# Altium schematic sheet Connectors.SchDoc: Connectors
size A4; CompanyName: St. Cloud State University; Organization: Senior Design Project; Address1: Prosthetic Hand; Address2: Matthew Varas; Address3: Rachel Mertz; Address4: Donnell Jones; DocumentNumber: 2; Revision: 1.1; SheetNumber: 2; SheetTotal: 6
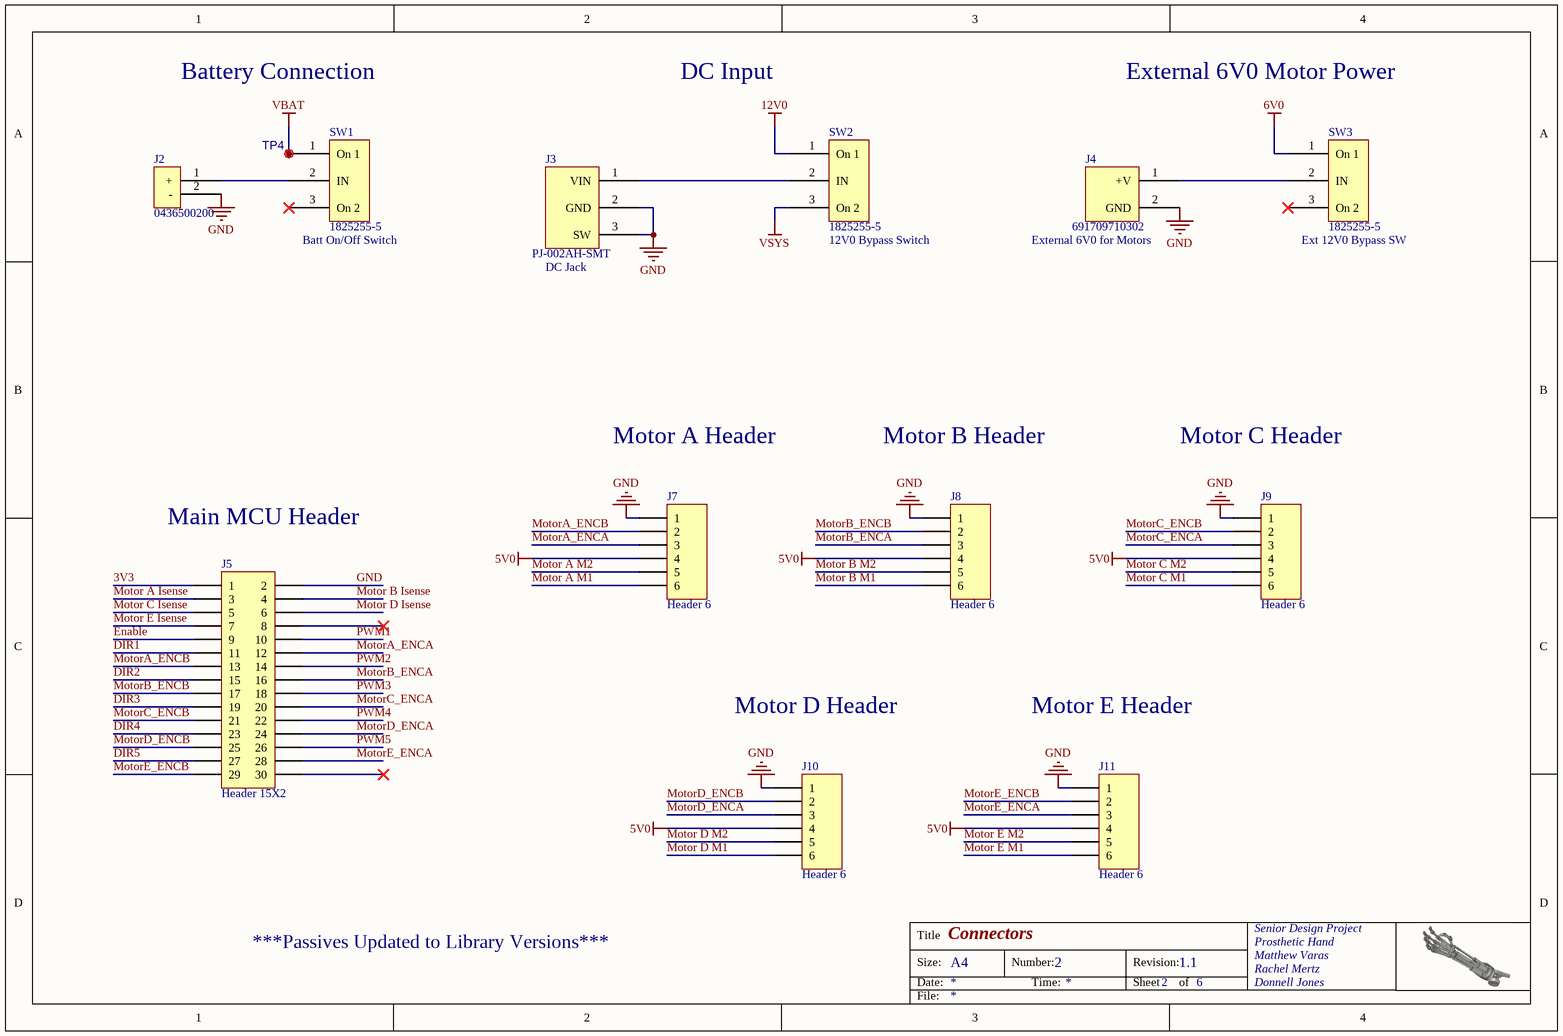
[diagram p0: Connectors.SchDoc]

## Parts
J2  0436500200  [43650-0200]
J3  PJ-002AH-SMT  [PJ-002AH-SMT]
J4  691709710302  [2-Pin Screw Terminal]
J5  Header 15X2  [HDR2X15]
J7  Header 6  [HDR1X6]
J8  Header 6  [HDR1X6]
J9  Header 6  [HDR1X6]
J10  Header 6  [HDR1X6]
J11  Header 6  [HDR1X6]
SW1  1825255-5  [On/Off/On Slider Switch]
SW2  1825255-5  [On/Off/On Slider Switch]
SW3  1825255-5  [On/Off/On Slider Switch]
TP4  Test Point  [Testpoint_70]  (value not drawn)

## Nets
5V0: J7.4 J8.4 J9.4 J10.4 J11.4
6V0: SW3.1(On_1)
12V0: SW2.1(On_1)
GND: J2.2(-) J3.2(GND) J3.3(SW) J4.2(GND) J5.2 J7.1 J8.1 J9.1 J10.1 J11.1
VBAT: SW1.1(On_1) TP4.1(M80)
VSYS: SW2.3(On_2)
3V3: J5.1
DIR1: J5.11
DIR2: J5.15
DIR3: J5.19
DIR4: J5.23
DIR5: J5.27
Enable: J5.9
Motor A Isense: J5.3
Motor A M1: J7.6
Motor A M2: J7.5
Motor B Isense: J5.4
Motor B M1: J8.6
Motor B M2: J8.5
Motor C Isense: J5.5
Motor C M1: J9.6
Motor C M2: J9.5
Motor D Isense: J5.6
Motor D M1: J10.6
Motor D M2: J10.5
Motor E Isense: J5.7
Motor E M1: J11.6
Motor E M2: J11.5
MotorA_ENCA: J5.12 J7.3
MotorA_ENCB: J5.13 J7.2
MotorB_ENCA: J5.16 J8.3
MotorB_ENCB: J5.17 J8.2
MotorC_ENCA: J5.20 J9.3
MotorC_ENCB: J5.21 J9.2
MotorD_ENCA: J5.24 J10.3
MotorD_ENCB: J5.25 J10.2
MotorE_ENCA: J5.28 J11.3
MotorE_ENCB: J5.29 J11.2
PWM1: J5.10
PWM2: J5.14
PWM3: J5.18
PWM4: J5.22
PWM5: J5.26
NetJ2_1: J2.1(+) SW1.2(IN)
NetJ3_1: J3.1(VIN) SW2.2(IN)
NetJ4_1: J4.1(+V) SW3.2(IN)

Not connected (* = marked no-connect by the designer): J5 8* 30*; SW1 3(On_2)*; SW3 3(On_2)*

## Notes on the sheet
- Battery Connection
- DC Input
- External 6V0 Motor Power
- Motor A Header
- Motor B Header
- Motor C Header
- Main MCU Header
- Motor D Header
- Motor E Header
- ***Passives Updated to Library Versions***
- Title
- Size:
- Date:
- A4
- Number:
- Time:
- Revision:
- Sheet
- of
- File:
- (in symbol 1825255-5) Batt On/Off Switch; 12V0 Bypass Switch; Ext 12V0 Bypass SW
- (in symbol PJ-002AH-SMT) DC Jack
- (in symbol Screw Terminal 2-pin) External 6V0 for Motors

## Library data of the parts
J2 = Battery Connector: CONN HEADER 2POS 3MM RT ANG TIN; MFG_NAME01: Molex; DIGI_PN01: WM1860-ND; MFG_PN01: 43650-0200
J3 = PJ-002AH-SMT: CONN POWER JACK 2.1X5.5MM HI CUR; MFG_PN01: PJ-002AH-SMT-TR; DIGI_PN01: CP-002AHPJCT-ND; MFG_NAME01: CUI Inc.
J4 = Screw Terminal 2-pin: CONN TERM BLOCK 2POS 5MM BLACK; MFG_NAME01: Wurth Electronics Inc; DIGI_PN01: 1297-1108-1-ND; MFG_PN01: 691709710302
J5 = Header 15X2: 30 Position Receptacle Connector 0.100" (2.54mm) Through Hole Tin; MFG_PN01: SSW-115-01-T-D; DIGI_PN01: SAM1212-15-ND; MFG_NAME01: Samtec Inc
J7-J11 = Header 6: 6 Positions Header, Unshrouded Connector 0.100" (2.54mm) Through Hole Tin; MFG_PN01: 3-644456-6; MFG_NAME01: TE Connectivity; DIGI_PN01: A31116-ND
SW1-SW3 = 1825255-5: SWITCH SLIDE SPDT 300MA 125V; MFG_NAME01: TE Connectivity; DIGI_PN01: 450-1569-ND; MFG_PN01: 1825255-5
TP4 = Test Point: Test Pad; MFG_PN01: DNP; MFG_NAME01: DNP; DNP: DNP